# Altium schematic sheet 20_V2X_MODEM.SchDoc
size A3; SheetNumber: 21; SheetTotal: 24
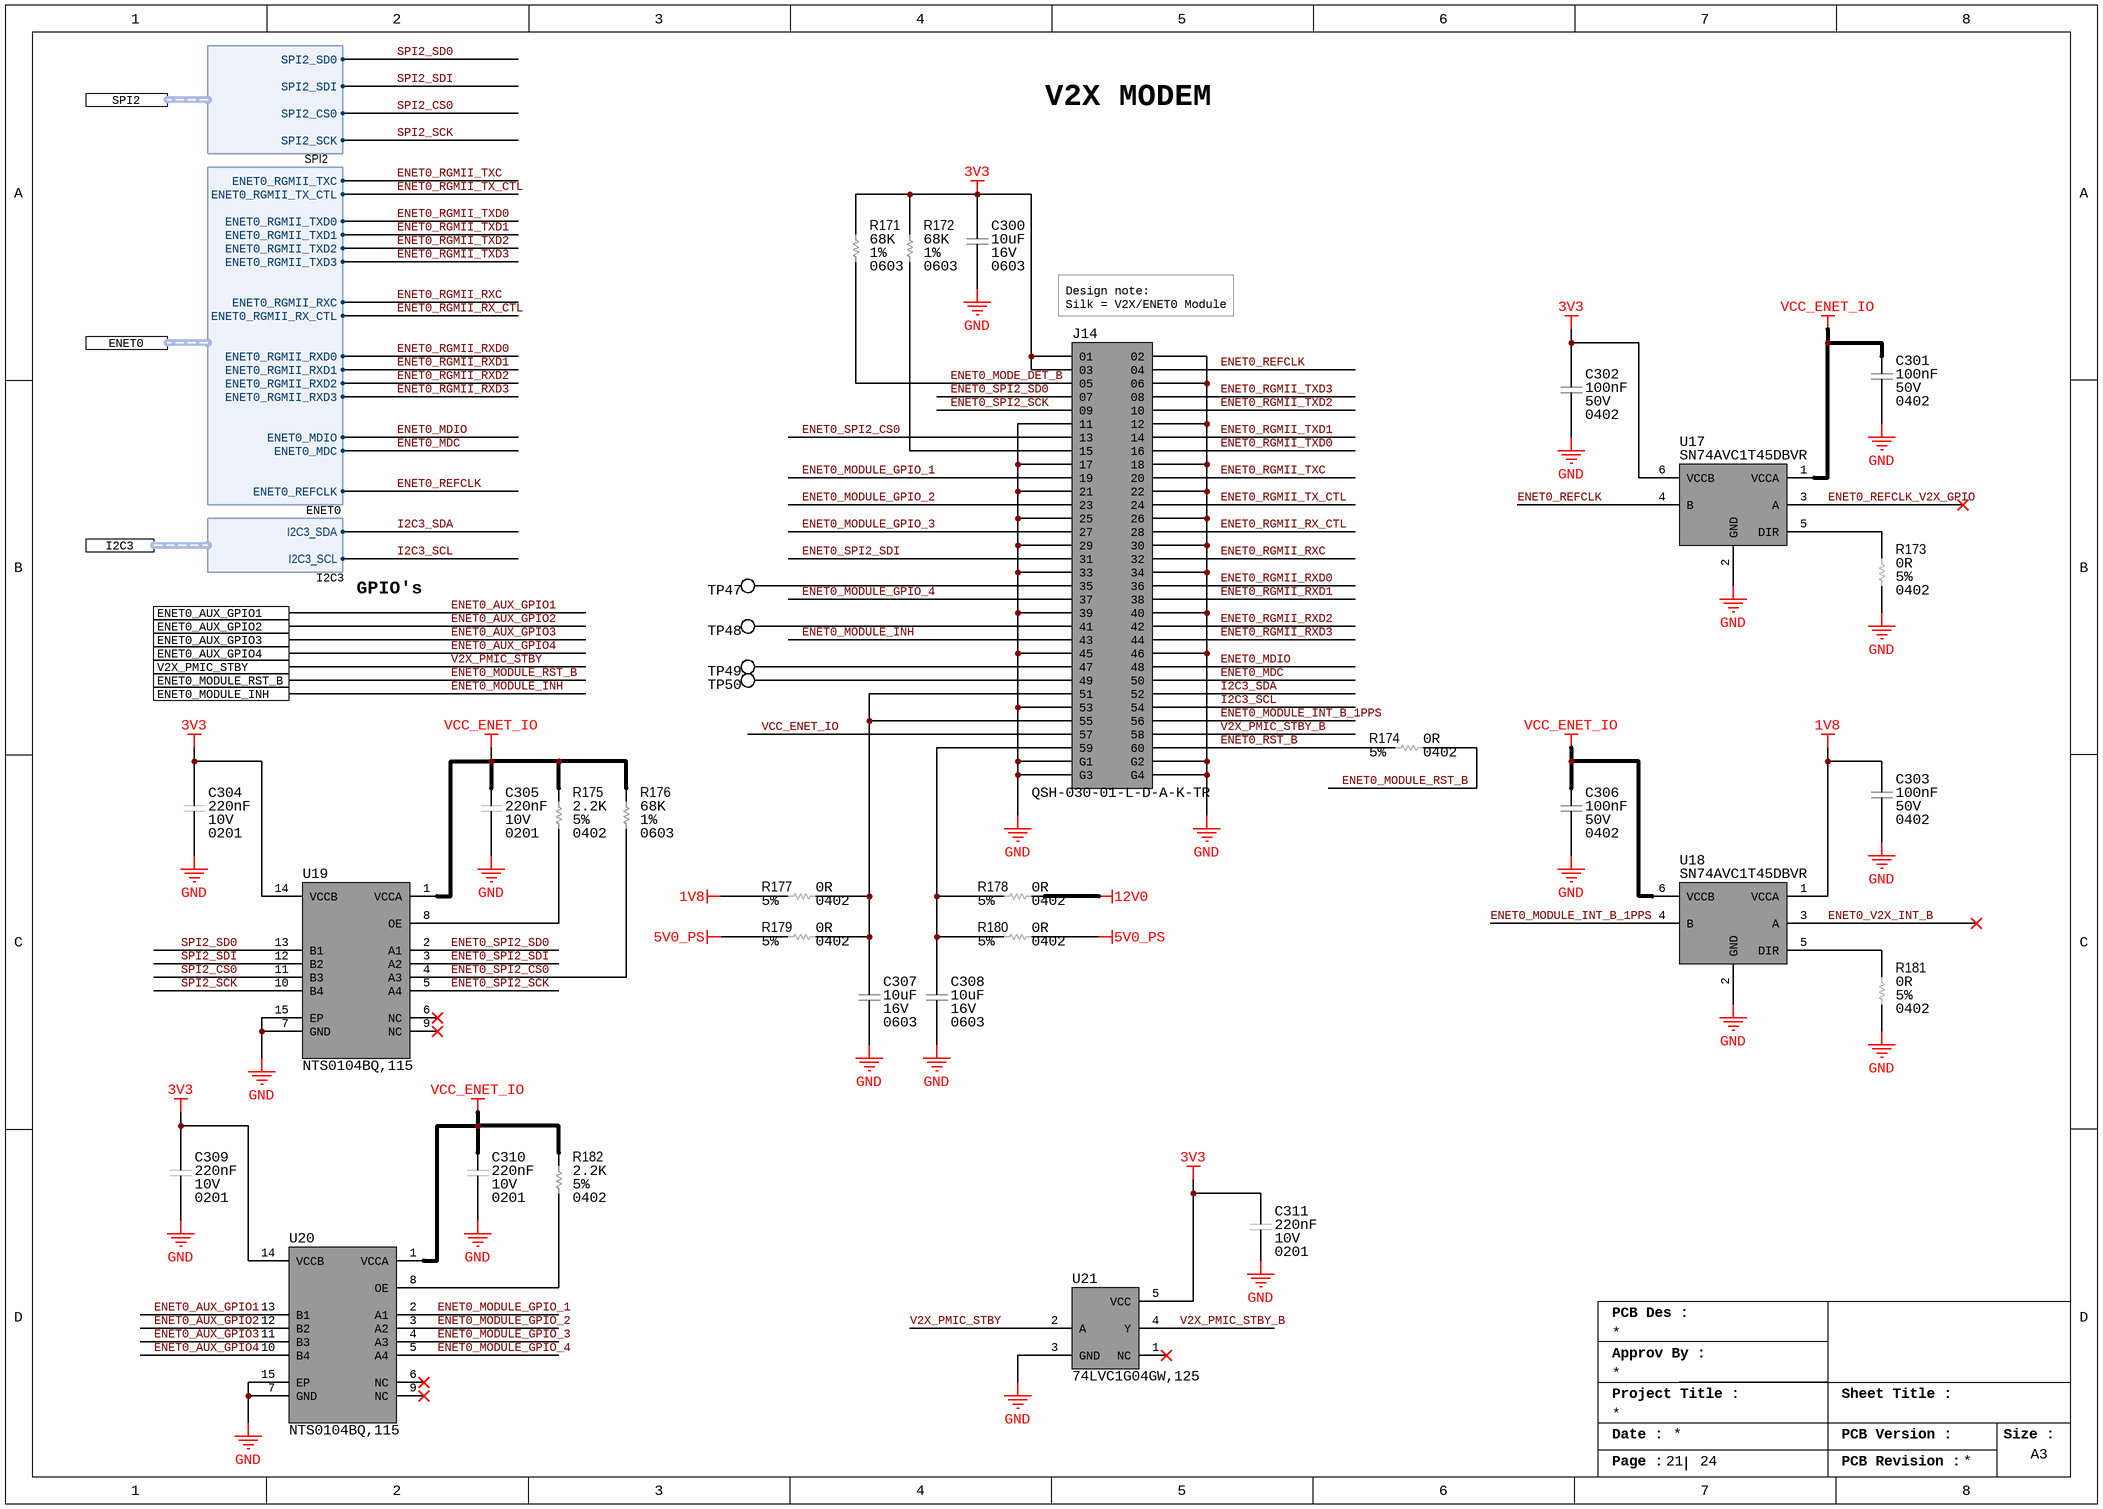
[diagram p0: 20_V2X_MODEM.SchDoc]

## Parts
C300  Voltage Rating: 16V  Capacitance: 10uF  Case/Package: 0603  [CAP_0603_CAPC1608X08N]  (hidden comment: GRM188R61C106MAALD)
C301  Voltage Rating: 50V  Capacitance: 100nF  Case/Package: 0402  [CAP_0402_CAPC1005X05N]  (hidden comment: GRM155R71H104KE14D)
C302  Voltage Rating: 50V  Capacitance: 100nF  Case/Package: 0402  [CAP_0402_CAPC1005X05N]  (hidden comment: GRM155R71H104KE14D)
C303  Voltage Rating: 50V  Capacitance: 100nF  Case/Package: 0402  [CAP_0402_CAPC1005X05N]  (hidden comment: GRM155R71H104KE14D)
C304  Voltage Rating (DC): 10V  Capacitance: 220nF  Case/Package: 0201  [CAP_0201_CAPC0603X03N]  (hidden comment: LMK063BJ224MP-F)
C305  Voltage Rating (DC): 10V  Capacitance: 220nF  Case/Package: 0201  [CAP_0201_CAPC0603X03N]  (hidden comment: LMK063BJ224MP-F)
C306  Voltage Rating: 50V  Capacitance: 100nF  Case/Package: 0402  [CAP_0402_CAPC1005X05N]  (hidden comment: GRM155R71H104KE14D)
C307  Voltage Rating: 16V  Capacitance: 10uF  Case/Package: 0603  [CAP_0603_CAPC1608X08N]  (hidden comment: GRM188R61C106MAALD)
C308  Voltage Rating: 16V  Capacitance: 10uF  Case/Package: 0603  [CAP_0603_CAPC1608X08N]  (hidden comment: GRM188R61C106MAALD)
C309  Voltage Rating (DC): 10V  Capacitance: 220nF  Case/Package: 0201  [CAP_0201_CAPC0603X03N]  (hidden comment: LMK063BJ224MP-F)
C310  Voltage Rating (DC): 10V  Capacitance: 220nF  Case/Package: 0201  [CAP_0201_CAPC0603X03N]  (hidden comment: LMK063BJ224MP-F)
C311  Voltage Rating (DC): 10V  Capacitance: 220nF  Case/Package: 0201  [CAP_0201_CAPC0603X03N]  (hidden comment: LMK063BJ224MP-F)
J14  QSH-030-01-L-D-A-K-TR  [SAMTEC_QSH-030-01-X-D-A-XX]
R171  Tolerance: 1%  Resistance: 68K  Case/Package: 0603  [RES_0603_RESC1608X04N]  (hidden comment: RC0603FR-0768KL)
R172  Tolerance: 1%  Resistance: 68K  Case/Package: 0603  [RES_0603_RESC1608X04N]  (hidden comment: RC0603FR-0768KL)
R173  Case Code (Imperial): 0402  Tolerance: 5%  Resistance: 0R  [RES_0402_RESC1005X04N]  (hidden comment: ERJ-2GE0R00X)
R174  Case Code (Imperial): 0402  Tolerance: 5%  Resistance: 0R  [RES_0402_RESC1005X04N]  (hidden comment: ERJ-2GE0R00X)
R175  Tolerance: 5%  Resistance: 2.2K  Case/Package: 0402  [RES_0402_RESC1005X04N]  (hidden comment: RC0402JR-072K2L)
R176  Tolerance: 1%  Resistance: 68K  Case/Package: 0603  [RES_0603_RESC1608X04N]  (hidden comment: RC0603FR-0768KL)
R177  Case Code (Imperial): 0402  Tolerance: 5%  Resistance: 0R  [RES_0402_RESC1005X04N]  (hidden comment: ERJ-2GE0R00X)
R178  Case Code (Imperial): 0402  Tolerance: 5%  Resistance: 0R  [RES_0402_RESC1005X04N]  (hidden comment: ERJ-2GE0R00X)
R179  Case Code (Imperial): 0402  Tolerance: 5%  Resistance: 0R  [RES_0402_RESC1005X04N]  (hidden comment: ERJ-2GE0R00X)
R180  Case Code (Imperial): 0402  Tolerance: 5%  Resistance: 0R  [RES_0402_RESC1005X04N]  (hidden comment: ERJ-2GE0R00X)
R181  Case Code (Imperial): 0402  Tolerance: 5%  Resistance: 0R  [RES_0402_RESC1005X04N]  (hidden comment: ERJ-2GE0R00X)
R182  Tolerance: 5%  Resistance: 2.2K  Case/Package: 0402  [RES_0402_RESC1005X04N]  (hidden comment: RC0402JR-072K2L)
TP47  NO COMPONENT  [TP_PAD_0.5MM_SMD_ROUND]  (value not drawn)  (no BOM)
TP48  NO COMPONENT  [TP_PAD_0.5MM_SMD_ROUND]  (value not drawn)  (no BOM)
TP49  NO COMPONENT  [TP_PAD_0.5MM_SMD_ROUND]  (value not drawn)  (no BOM)
TP50  NO COMPONENT  [TP_PAD_0.5MM_SMD_ROUND]  (value not drawn)  (no BOM)
U17  SN74AVC1T45DBVR  [SOT95P280X145-6N]
U18  SN74AVC1T45DBVR  [SOT95P280X145-6N]
U19  NTS0104BQ,115  [QFN50P300X250X100-15N]
U20  NTS0104BQ,115  [QFN50P300X250X100-15N]
U21  74LVC1G04GW,125  [SOT65P210X110-5N]

## Ports
ENET0 (harness ENET0), ENET0_AUX_GPIO1, ENET0_AUX_GPIO2, ENET0_AUX_GPIO3, ENET0_AUX_GPIO4, ENET0_MODULE_INH, ENET0_MODULE_RST_B, I2C3 (harness I2C3), SPI2 (harness SPI2), V2X_PMIC_STBY

## Harnesses
SPI2: SPI2_SD0, SPI2_SDI, SPI2_CS0, SPI2_SCK
ENET0: ENET0_RGMII_TXC, ENET0_RGMII_TX_CTL, ENET0_RGMII_TXD0, ENET0_RGMII_TXD1, ENET0_RGMII_TXD2, ENET0_RGMII_TXD3, ENET0_RGMII_RXC, ENET0_RGMII_RX_CTL, ENET0_RGMII_RXD0, ENET0_RGMII_RXD1, ENET0_RGMII_RXD2, ENET0_RGMII_RXD3, ENET0_MDIO, ENET0_MDC, ENET0_REFCLK
I2C3: I2C3_SDA, I2C3_SCL

## Nets
1V8: C303.2 R177.1 U18.1(VCCA)
3V3: C300.2 C302.2 C304.1 C309.1 C311.1 J14.01 J14.03 R171.2 R172.2 U17.6(VCCB) U19.14(VCCB) U20.14(VCCB) U21.5(VCC)
5V0_PS: R179.1 R180.2
12V0: R178.2
GND: C300.1 C301.1 C302.1 C303.1 C304.2 C305.2 C306.1 C307.1 C308.1 C309.2 C310.2 C311.2 J14.02 J14.06 J14.11 J14.12 J14.17 J14.18 J14.21 J14.22 J14.25 J14.26 J14.29 J14.30 J14.33 J14.34 J14.39 J14.40 J14.45 J14.46 J14.53 J14.G1 J14.G2 J14.G3 J14.G4 R173.1 R181.1 U17.2(GND) U18.2(GND) U19.7(GND) U19.15(EP) U20.7(GND) U20.15(EP) U21.3(GND)
VCC_ENET_IO: C301.2 C305.1 C306.2 C310.1 J14.57 R175.2 R176.2 R182.2 U17.1(VCCA) U18.6(VCCB) U19.1(VCCA) U20.1(VCCA)
ENET0_AUX_GPIO1: U20.13(B1) ; port ENET0_AUX_GPIO1
ENET0_AUX_GPIO2: U20.12(B2) ; port ENET0_AUX_GPIO2
ENET0_AUX_GPIO3: U20.11(B3) ; port ENET0_AUX_GPIO3
ENET0_AUX_GPIO4: U20.10(B4) ; port ENET0_AUX_GPIO4
ENET0_MDC: J14.50 ; port ENET0.ENET0_MDC
ENET0_MDIO: J14.48 ; port ENET0.ENET0_MDIO
ENET0_MODE_DET_B: J14.05 R171.1
ENET0_MODULE_GPIO_1: J14.19 U20.2(A1)
ENET0_MODULE_GPIO_2: J14.23 U20.3(A2)
ENET0_MODULE_GPIO_3: J14.27 U20.4(A3)
ENET0_MODULE_GPIO_4: J14.37 U20.5(A4)
ENET0_MODULE_INH: J14.43 ; port ENET0_MODULE_INH
ENET0_MODULE_INT_B_1PPS: J14.56 U18.4(B)
ENET0_MODULE_RST_B: R174.2 ; port ENET0_MODULE_RST_B
ENET0_REFCLK: J14.04 U17.4(B) ; port ENET0.ENET0_REFCLK
ENET0_REFCLK_V2X_GPIO: U17.3(A)
ENET0_RGMII_RX_CTL: J14.28 ; port ENET0.ENET0_RGMII_RX_CTL
ENET0_RGMII_RXC: J14.32 ; port ENET0.ENET0_RGMII_RXC
ENET0_RGMII_RXD0: J14.36 ; port ENET0.ENET0_RGMII_RXD0
ENET0_RGMII_RXD1: J14.38 ; port ENET0.ENET0_RGMII_RXD1
ENET0_RGMII_RXD2: J14.42 ; port ENET0.ENET0_RGMII_RXD2
ENET0_RGMII_RXD3: J14.44 ; port ENET0.ENET0_RGMII_RXD3
ENET0_RGMII_TX_CTL: J14.24 ; port ENET0.ENET0_RGMII_TX_CTL
ENET0_RGMII_TXC: J14.20 ; port ENET0.ENET0_RGMII_TXC
ENET0_RGMII_TXD0: J14.16 ; port ENET0.ENET0_RGMII_TXD0
ENET0_RGMII_TXD1: J14.14 ; port ENET0.ENET0_RGMII_TXD1
ENET0_RGMII_TXD2: J14.10 ; port ENET0.ENET0_RGMII_TXD2
ENET0_RGMII_TXD3: J14.08 ; port ENET0.ENET0_RGMII_TXD3
ENET0_RST_B: J14.60 R174.1
ENET0_SPI2_CS0: J14.13 R176.1 U19.4(A3)
ENET0_SPI2_SCK: J14.09 U19.5(A4)
ENET0_SPI2_SD0: J14.07 U19.2(A1)
ENET0_SPI2_SDI: J14.31 U19.3(A2)
ENET0_V2X_INT_B: U18.3(A)
I2C3_SCL: J14.54 ; port I2C3.I2C3_SCL
I2C3_SDA: J14.52 ; port I2C3.I2C3_SDA
SPI2_CS0: U19.11(B3) ; port SPI2.SPI2_CS0
SPI2_SCK: U19.10(B4) ; port SPI2.SPI2_SCK
SPI2_SD0: U19.13(B1) ; port SPI2.SPI2_SD0
SPI2_SDI: U19.12(B2) ; port SPI2.SPI2_SDI
V2X_PMIC_STBY: U21.2(A) ; port V2X_PMIC_STBY
V2X_PMIC_STBY_B: J14.58 U21.4(Y)
NetC307_2: C307.2 J14.51 J14.55 R177.2 R179.2
NetC308_2: C308.2 J14.59 R178.1 R180.1
NetJ14_15: J14.15 R172.1
NetJ14_35: J14.35 TP47.1
NetJ14_41: J14.41 TP48.1
NetJ14_47: J14.47 TP49.1
NetJ14_49: J14.49 TP50.1
NetR173_2: R173.2 U17.5(DIR)
NetR175_1: R175.1 U19.8(OE)
NetR181_2: R181.2 U18.5(DIR)
NetR182_1: R182.1 U20.8(OE)

Not connected (* = marked no-connect by the designer): U19 6(NC)* 9(NC)*; U20 6(NC)* 9(NC)*; U21 1(NC)*

## Notes on the sheet
- V2X MODEM
- (near J14) Design note:
  Silk = V2X/ENET0 Module
- GPIO's
- PCB Des :
- Approv By :
- Project Title :
- Sheet Title :
- Date :
- PCB Version :
- Size :
- A3
- Page :
- PCB Revision :

## Library data of the parts
C300 C307 C308 = CAP_10UF_16V_X5R_0603: 0603 10 uF 16 V ±20% Tolerance X5R Multilayer Ceramic Chip Capacitor; Manufacturer: Murata; Manufacturer Part Number: GRM188R61C106MAALD; RoHS: Yes; Category: Ceramic Capacitors; Stock 1: 566627; Pricing 1: 1=0.24000, 10=0.16500, 50=0.11000, 100=0.09340, 500=0.06596, 1000=0.05771 (USD); Mount: Surface Mount; Case Code (Metric): 1608; Material: Ceramic; Case Code (Imperial): 0603; Min Operating Temperature: -55°C; Max Operating Temperature: 85°C; Tolerance: 20%; Packaging: Cut Tape; Voltage Rating (DC): 16V; Length: 0.063inch; Width: 0.031inch; Height: 0.8mm; Thickness: 0.037inch; Lead Free: Lead Free; RoHS Compliant: Yes; ComponentLink1URL: http://search.murata.co.jp/Ceramy/image/img/A01X/G101/ENG/GRM188R61C106MAAL-01.pdf?src-supplier=Digi-Key; ComponentLink1Description: http://search.murata.co.jp/Ceramy/image/img/A01X/G101/ENG/GRM188R61C106MAAL-01.pdf?src-supplier=Digi-Key; ComponentLink2URL: https://search.murata.co.jp/Ceramy/image/img/A01X/G101/ENG/GRM188R61C106MAAL-01.pdf?src-supplier=Digi-Key; ComponentLink2Description: https://search.murata.co.jp/Ceramy/image/img/A01X/G101/ENG/GRM188R61C106MAAL-01.pdf?src-supplier=Digi-Key; ComponentLink3URL: http://search.murata.co.jp/Ceramy/image/img/A01X/partnumbering_e_01.pdf?src-supplier=Digi-Key; ComponentLink3Description: http://search.murata.co.jp/Ceramy/image/img/A01X/partnumbering_e_01.pdf?src-supplier=Digi-Key; Supplier 1: Digi-Key; Supplier 2: Verical; Supplier 3: Mouser; Supplier Part Number 1: 490-10729-1-ND; Supplier Part Number 2: GRM188R61C106MAALD; Supplier Part Number 3: 81-GRM188R61C106MALD
C301-C303 C306 = CAP_100NF_50V_X7R_0402: Multilayer Ceramic Capacitor, 0.1 uF, 16 V, ± 10%, X7R, 0402 [1005 Metric]; Manufacturer: Murata; Dissipation Factor: 0.025%; Temperature Coefficient: 30ppm/°C; Supplier 1: DigiKey; Manufacturer Part Number: GRM155R71H104KE14D; RoHS: Yes; Category: Ceramic Capacitors; Stock 1: 13730790; Pricing 1: 1=0.1, 10=0.023, 50=0.0132, 100=0.0102, 500=0.00768, 1000=0.00603, 2500=0.00548, 5000=0.00504 (USD); Mount: Surface Mount; Number of Pins: 2NUMBER; Case Code (Metric): 1005; Material: Ceramic; Case Code (Imperial): 0402; Weight: 0.000212oz; Dielectric Material: Ceramic; Min Operating Temperature: -55°C; Max Operating Temperature: 125°C; Packaging: Tape and Reel; Package Quantity: 10000; Series: GRM; Tolerance: 10%; Dielectric: X7R; Termination: SMD/SMT; Voltage: 50V; Voltage Rating (DC): 50V; Construction: Flat; Length: 1mm; Width: 0.5mm; Height: 0.5mm; Depth: 0.5mm; Thickness: 0.022inch; Reach SVHC Compliant: No; RoHS Compliant: Yes; Lead Free: 5697LeadFree; ComponentLink1URL: http://www.farnell.com/datasheets/2079156.pdf?src-supplier=Farnell; ComponentLink1Description: http://www.farnell.com/datasheets/2079156.pdf?src-supplier=Farnell; ComponentLink2URL: http://www.mouser.com/ds/2/281/c02e-2905.pdf?src-supplier=Mouser; ComponentLink2Description: http://www.mouser.com/ds/2/281/c02e-2905.pdf?src-supplier=Mouser; ComponentLink3URL: http://www.farnell.com/datasheets/2079156.pdf?src-supplier=Newark; ComponentLink3Description: http://www.farnell.com/datasheets/2079156.pdf?src-supplier=Newark; ComponentLink4URL: https://datasheet.octopart.com/GRM155R71H104KE14D-Murata-datasheet-22122223.pdf?src-supplier=Future+Electronics; ComponentLink4Description: https://datasheet.octopart.com/GRM155R71H104KE14D-Murata-datasheet-22122223.pdf?src-supplier=Future+Electronics; ComponentLink5URL: https://search.murata.co.jp/Ceramy/image/img/A01X/G101/ENG/GRM155R71H104KE14-01.pdf?src-supplier=Digi-Key; ComponentLink5Description: https://search.murata.co.jp/Ceramy/image/img/A01X/G101/ENG/GRM155R71H104KE14-01.pdf?src-supplier=Digi-Key; ComponentLink6URL: http://psearch.en.murata.com/capacitor/product/GRM155R71H104KE14%23.pdf?src-supplier=Avnet; ComponentLink6Description: http://psearch.en.murata.com/capacitor/product/GRM155R71H104KE14%23.pdf?src-supplier=Avnet; ComponentLink7URL: https://datasheet.octopart.com/GRM155R71H104KE14D-Murata-datasheet-66077078.pdf?src-supplier=Element14; ComponentLink7Description: https://datasheet.octopart.com/GRM155R71H104KE14D-Murata-datasheet-66077078.pdf?src-supplier=Element14; Supplier Part Number 1: 490-10700-6-ND; Supplier 2: Digikey; Stock 2: 3706055; Pricing 2: 1=0.1, 10=0.037, 50=0.021, 100=0.0162, 500=0.01224, 1000=0.00961, 2500=0.00874, 5000=0.00804 (USD); Halogen Free: 5694HalogenFree; ComponentLink8URL: http://www.mouser.com/ds/2/447/UPY-GPHC_X5R_4V-to-50V_25-1131599.pdf?src-supplier=Mouser; ComponentLink8Description: http://www.mouser.com/ds/2/447/UPY-GPHC_X5R_4V-to-50V_25-1131599.pdf?src-supplier=Mouser; ComponentLink9URL: https://datasheet.octopart.com/CC0402KRX5R8BB104-Yageo-datasheet-137700082.pdf?src-supplier=Future+Electronics; ComponentLink9Description: https://datasheet.octopart.com/CC0402KRX5R8BB104-Yageo-datasheet-137700082.pdf?src-supplier=Future+Electronics; ComponentLink10URL: http://www.yageo.com/documents/recent/UPY-GPHC_X5R_4V-to-50V_25.pdf?src-supplier=Digikey; ComponentLink10Description: http://www.yageo.com/documents/recent/UPY-GPHC_X5R_4V-to-50V_25.pdf?src-supplier=Digikey; ComponentLink11URL: https://datasheet.octopart.com/CC0402KRX5R8BB104-Yageo-datasheet-140260304.pdf?src-supplier=Newark; ComponentLink11Description: https://datasheet.octopart.com/CC0402KRX5R8BB104-Yageo-datasheet-140260304.pdf?src-supplier=Newark; ComponentLink12URL: https://datasheet.octopart.com/CC0402KRX5R8BB104-Yageo-datasheet-170350636.pdf?src-supplier=Future+Electronics; ComponentLink12Description: https://datasheet.octopart.com/CC0402KRX5R8BB104-Yageo-datasheet-170350636.pdf?src-supplier=Future+Electronics; ComponentLink13URL: http://www.yageo.com/documents/recent/UPY-GPHC_X5R_4V-to-50V-16.pdf?src-supplier=Future+Electronics; ComponentLink13Description: http://www.yageo.com/documents/recent/UPY-GPHC_X5R_4V-to-50V-16.pdf?src-supplier=Future+Electronics; Supplier Part Number 2: 311-1697-1-ND
C304 C305 C309-C311 = CAP_0.22UF_10V_X5R_0201: Multilayer Ceramic Capacitors (High dielectric type), 10V, 0.22 uF, ± 20 %, 0201, X5R, RoHS; Manufacturer: Taiyo Yuden; Material: 4241ConductorMaterial; Tolerance: 20%; Supplier 1: Digikey; Manufacturer Part Number: LMK063BJ224MP-F; RoHS: Yes; Category: Ceramic Capacitors; Stock 1: 6053224; Pricing 1: 1=0.12, 10=0.08, 50=0.0478, 100=0.0375, 500=0.02772, 1000=0.02295, 2500=0.02136, 5000=0.01954 (USD); Mount: Surface Mount; Case Code (Metric): 0603; Case Code (Imperial): 0201; Min Operating Temperature: -55°C; Max Operating Temperature: 85°C; Voltage Rating: 10V; Packaging: Tape and Reel; Package Quantity: 15000; Dielectric: X5R; Termination: SMD/SMT; Voltage: 10V; Series: M; Construction: Flat; Length: 0.6mm; Width: 0.3mm; Height: 0.3mm; Depth: 0.3mm; Radiation Hardening: No; Halogen Free: Halogen Free; RoHS Compliant: Yes; Reach SVHC Compliant: Unknown; ComponentLink1URL: https://datasheet.ciiva.com/134/lmk063bj224mp-f-ss-134995.pdf?src-supplier=Digikey; ComponentLink1Description: https://datasheet.ciiva.com/134/lmk063bj224mp-f-ss-134995.pdf?src-supplier=Digikey; ComponentLink2URL: https://datasheet.ciiva.com/11464/lmk063bj224mp-f-ss-11464053.pdf?src-supplier=Avnet; ComponentLink2Description: https://datasheet.ciiva.com/11464/lmk063bj224mp-f-ss-11464053.pdf?src-supplier=Avnet; ComponentLink3URL: https://datasheet.ciiva.com/15921/1589lmk063bj224mp-f-15921250.pdf?src-supplier=Onlinecomponents.com; ComponentLink3Description: https://datasheet.ciiva.com/15921/1589lmk063bj224mp-f-15921250.pdf?src-supplier=Onlinecomponents.com; ComponentLink4URL: https://datasheet.ciiva.com/26872/getdatasheetpartid-639019-26872592.pdf?src-supplier=Verical; ComponentLink4Description: https://datasheet.ciiva.com/26872/getdatasheetpartid-639019-26872592.pdf?src-supplier=Verical; ComponentLink5URL: https://datasheet.ciiva.com/30243/100lmk063bj224mp-f-30243150.pdf?src-supplier=Onlinecomponents.com; ComponentLink5Description: https://datasheet.ciiva.com/30243/100lmk063bj224mp-f-30243150.pdf?src-supplier=Onlinecomponents.com; ComponentLink6URL: https://datasheet.ciiva.com/28645/746258-28645141.pdf?src-supplier=Element14; ComponentLink6Description: https://datasheet.ciiva.com/28645/746258-28645141.pdf?src-supplier=Element14; ComponentLink7URL: https://datasheet.ciiva.com/5422/mlcc-all-e-541559-5422365.pdf?src-supplier=Mouser; ComponentLink7Description: https://datasheet.ciiva.com/5422/mlcc-all-e-541559-5422365.pdf?src-supplier=Mouser; Supplier Part Number 1: 587-2483-1-ND
J14 = CONN_MEZZANINE_60P_0.5mm_QSH-030-01-L-D-A-K-TR: Board to Board & Mezzanine Connectors 0.50 mm Q Strip High-Speed Ground Plane Socket Strip; Manufacturer: Samtec; Number of Contacts: 60; Max Voltage Rating (AC): 125V; Gender: Female; Pitch: 0.5mm; Supplier 1: Digikey; Manufacturer Part Number: QSH-030-01-L-D-A-K-TR; RoHS: Yes; Category: Connectors; Stock 1: 6997; Pricing 1: 1=5.77, 50=5.29, 100=4.96, 250=4.47 (USD); Contact Plating: Gold; Contact Material: Bronze; Housing Color: Black; Housing Material: Polymer; Min Operating Temperature: -55°C; Max Operating Temperature: 125°C; Number of Rows: 2; Packaging: Tape and Reel; Termination: Solder; Orientation: Straight; Voltage Rating (AC): 125V; Length: 21.27mm; Depth: 7.49mm; Radiation Hardening: No; Lead Free: Lead Free; RoHS Compliant: Yes; ComponentLink1URL: https://datasheet.ciiva.com/9698/qsh-9698069.pdf?src-supplier=Avnet; ComponentLink1Description: https://datasheet.ciiva.com/9698/qsh-9698069.pdf?src-supplier=Avnet; ComponentLink2URL: https://datasheet.ciiva.com/9698/qsh-9698108.pdf?src-supplier=Avnet; ComponentLink2Description: https://datasheet.ciiva.com/9698/qsh-9698108.pdf?src-supplier=Avnet; ComponentLink3URL: https://datasheet.ciiva.com/9698/qsh-9698110.pdf?src-supplier=Avnet; ComponentLink3Description: https://datasheet.ciiva.com/9698/qsh-9698110.pdf?src-supplier=Avnet; Supplier Part Number 1: 612-QSH-030-01-L-D-A-K-TRCT-ND
R171 R172 R176 = RES_68K_1%_100mW_0603: SMD Chip Resistor, 68 kOhm, ± 1%, 100 mW, 0603 [1608 Metric], Thick Film, General Purpose; Manufacturer: Yageo; Power Rating: 100mW; Voltage Rating: 50V; Temperature Coefficient: 100ppm/°C; Supplier 1: Digikey; Manufacturer Part Number: RC0603FR-0768KL; RoHS: Yes; Category: Chip SMD Resistors; Stock 1: 465324; Pricing 1: 1=0.1, 10=0.012, 50=0.0096, 100=0.0071, 500=0.00662, 1000=0.00612 (USD); Number of Pins: 2; Case Code (Metric): 1608; Case Code (Imperial): 0603; Size Code: 0603; Min Operating Temperature: -55°C; Max Operating Temperature: 155°C; Package Quantity: 1; Packaging: Tape and Reel; Voltage Rating (DC): 50V; Resistor Type: Thick Film; Number of Terminations: 2; Termination: SMD/SMT; Max Power Dissipation: 100mW; Features: Moisture Resistant; Series: RC; Resistance Tolerance: 1%; Technology: THICK FILM; Voltage Rating (AC): 50V; Length: 0.063inch; Width: 0.031inch; Height: 0.022inch; Depth: 0.8mm; Reach SVHC Compliant: No; Lead Free: Lead Free; RoHS Compliant: Yes; ComponentLink1URL: https://datasheet.ciiva.com/11819/0900766b80f96399-11819412.pdf?src-supplier=Rs; ComponentLink1Description: https://datasheet.ciiva.com/11819/0900766b80f96399-11819412.pdf?src-supplier=Rs; ComponentLink2URL: https://datasheet.ciiva.com/2454/pyu-r-int-thick-7-2454147.pdf?src-supplier=Digikey; ComponentLink2Description: https://datasheet.ciiva.com/2454/pyu-r-int-thick-7-2454147.pdf?src-supplier=Digikey; ComponentLink3URL: https://datasheet.ciiva.com/2454/pyu-r-int-thick-7-2454148.pdf?src-supplier=Digikey; ComponentLink3Description: https://datasheet.ciiva.com/2454/pyu-r-int-thick-7-2454148.pdf?src-supplier=Digikey; ComponentLink4URL: https://datasheet.ciiva.com/2454/pyu-r-int-thick-7-2454149.pdf?src-supplier=Digikey; ComponentLink4Description: https://datasheet.ciiva.com/2454/pyu-r-int-thick-7-2454149.pdf?src-supplier=Digikey; ComponentLink5URL: https://datasheet.ciiva.com/7983/443971-7983658.pdf?src-supplier=Element14; ComponentLink5Description: https://datasheet.ciiva.com/7983/443971-7983658.pdf?src-supplier=Element14; ComponentLink6URL: https://datasheet.ciiva.com/46412/443971-46412855.pdf?src-supplier=Element14; ComponentLink6Description: https://datasheet.ciiva.com/46412/443971-46412855.pdf?src-supplier=Element14; ComponentLink7URL: https://datasheet.ciiva.com/7746/443971-7746390.pdf?src-supplier=Element14; ComponentLink7Description: https://datasheet.ciiva.com/7746/443971-7746390.pdf?src-supplier=Element14; ComponentLink8URL: https://datasheet.ciiva.com/7746/443971-7746391.pdf?src-supplier=Element14; ComponentLink8Description: https://datasheet.ciiva.com/7746/443971-7746391.pdf?src-supplier=Element14; Supplier Part Number 1: 311-68.0KHRCT-ND
R173 R174 R177-R181 = RES_0R_5%_100mW_0402: SMD Chip Resistor, Jumper, 0 ohm, 100 mW, 0402 [1005 Metric], Thick Film, General Purpose; Manufacturer: Panasonic; Power Rating: 100mW; Voltage Rating: 50V; Temperature Coefficient: 600ppm/°C; Supplier 1: Mouser; Manufacturer Part Number: ERJ-2GE0R00X; RoHS: Yes; Category: Chip SMD Resistors; Stock 1: 10989354; Pricing 1: 1=0.1, 10=0.013, 50=0.013, 100=0.006, 1000=0.004, 2500=0.003, 10000=0.003 (USD); Mount: Surface Mount; Case/Package: 0402; Contact Plating: Tin; Case Code (Metric): 1005; Size Code: 0402; Min Operating Temperature: -55°C; Max Operating Temperature: 155°C; Resistor Type: Thick Film; Packaging: Cut Tape; Package Quantity: 10000; Number of Terminations: 2; Termination: SMD/SMT; Max Power Dissipation: 100mW; Voltage Rating (DC): 50V; Features: Automotive AEC-Q200; Series: ERJ; Construction: Rectangular; Technology: THICK FILM; Length: 1mm; Width: 0.5mm; Height: 0.35mm; Depth: 0.5mm; Ratings: AEC-Q200; Radiation Hardening: No; Reach SVHC Compliant: No; Military Standard: Not; Lead Free: Lead Free; RoHS Compliant: Yes; ComponentLink1URL: https://datasheet.ciiva.com/11821/0900766b80f806dd-11821176.pdf?src-supplier=Rs; ComponentLink1Description: https://datasheet.ciiva.com/11821/0900766b80f806dd-11821176.pdf?src-supplier=Rs; ComponentLink2URL: https://datasheet.ciiva.com/43460/1678796-43460347.pdf?src-supplier=Farnell; ComponentLink2Description: https://datasheet.ciiva.com/43460/1678796-43460347.pdf?src-supplier=Farnell; ComponentLink3URL: https://datasheet.ciiva.com/46389/1678796-46389518.pdf?src-supplier=Element14; ComponentLink3Description: https://datasheet.ciiva.com/46389/1678796-46389518.pdf?src-supplier=Element14; ComponentLink4URL: https://datasheet.ciiva.com/5959/1678796-5959692.pdf?src-supplier=Farnell; ComponentLink4Description: https://datasheet.ciiva.com/5959/1678796-5959692.pdf?src-supplier=Farnell; ComponentLink5URL: https://datasheet.ciiva.com/28695/1678796-28695758.pdf?src-supplier=Element14; ComponentLink5Description: https://datasheet.ciiva.com/28695/1678796-28695758.pdf?src-supplier=Element14; ComponentLink6URL: https://datasheet.ciiva.com/16783/70260739-16783734.pdf?src-supplier=Allied+Electronics; ComponentLink6Description: https://datasheet.ciiva.com/16783/70260739-16783734.pdf?src-supplier=Allied+Electronics; ComponentLink7URL: https://datasheet.ciiva.com/16778/70260739-16778335.pdf?src-supplier=Allied+Electronics; ComponentLink7Description: https://datasheet.ciiva.com/16778/70260739-16778335.pdf?src-supplier=Allied+Electronics; ComponentLink8URL: https://datasheet.ciiva.com/48531/aoa0000ce1-48531077.pdf?src-supplier=Avnet; ComponentLink8Description: https://datasheet.ciiva.com/48531/aoa0000ce1-48531077.pdf?src-supplier=Avnet; ComponentLink9URL: https://datasheet.ciiva.com/30097/4aoa0000ce1-30097116.pdf?src-supplier=Onlinecomponents.com; ComponentLink9Description: https://datasheet.ciiva.com/30097/4aoa0000ce1-30097116.pdf?src-supplier=Onlinecomponents.com; Supplier Part Number 1: 667-ERJ-2GE0R00X
R175 R182 = RES_2.2K_5%_63mW_0402: SMD Chip Resistor, 2.2 kOhm, ± 5%, 63 mW, 0402 [1005 Metric], Thick Film, General Purpose; Manufacturer: Yageo; Power Rating: 62.5mW; Voltage Rating: 50V; Temperature Coefficient: 100ppm/°C; Max Power Dissipation: 63mW; Supplier 1: Mouser; Manufacturer Part Number: RC0402JR-072K2L; RoHS: Yes; Category: Chip SMD Resistors; Stock 1: 27488; Pricing 1: 1=0.1, 10=0.011, 50=0.011, 100=0.006, 1000=0.005, 10000=0.002 (USD); Case Code (Metric): 1005; Case Code (Imperial): 0402; Weight: 2.3E-05oz; Min Operating Temperature: -55°C; Max Operating Temperature: 155°C; Package Quantity: 1; Packaging: Tape and Reel; Resistor Type: Thick Film; Number of Terminations: 2; Termination: SMD/SMT; Working Voltage: 50V; Features: Moisture Resistant; Series: RC; Resistance Tolerance: 5%; Construction: Rectangular; Technology: THICK FILM; Voltage Rating (AC): 50V; Length: 1mm; Width: 0.02inch; Height: 0.016inch; Depth: 0.5mm; Reach SVHC Compliant: No; Military Standard: Not; RoHS Compliant: Yes; Lead Free: 5697LeadFree; ComponentLink1URL: https://datasheet.ciiva.com/2518/pyu-r-int-thick-7-2518881.pdf?src-supplier=Digikey; ComponentLink1Description: https://datasheet.ciiva.com/2518/pyu-r-int-thick-7-2518881.pdf?src-supplier=Digikey; ComponentLink2URL: https://datasheet.ciiva.com/2518/pyu-r-int-thick-7-2518882.pdf?src-supplier=Digikey; ComponentLink2Description: https://datasheet.ciiva.com/2518/pyu-r-int-thick-7-2518882.pdf?src-supplier=Digikey; ComponentLink3URL: https://datasheet.ciiva.com/2518/pyu-r-int-thick-7-2518880.pdf?src-supplier=Digikey; ComponentLink3Description: https://datasheet.ciiva.com/2518/pyu-r-int-thick-7-2518880.pdf?src-supplier=Digikey; ComponentLink4URL: https://datasheet.ciiva.com/12577/pyu-rc0402-51-rohs-l-6-r-12577433.pdf?src-supplier=Mouser; ComponentLink4Description: https://datasheet.ciiva.com/12577/pyu-rc0402-51-rohs-l-6-r-12577433.pdf?src-supplier=Mouser; ComponentLink5URL: https://datasheet.ciiva.com/7850/1018594-7850191.pdf?src-supplier=Element14; ComponentLink5Description: https://datasheet.ciiva.com/7850/1018594-7850191.pdf?src-supplier=Element14; ComponentLink6URL: https://datasheet.ciiva.com/7850/1018594-7850190.pdf?src-supplier=Element14; ComponentLink6Description: https://datasheet.ciiva.com/7850/1018594-7850190.pdf?src-supplier=Element14; ComponentLink7URL: https://datasheet.ciiva.com/16741/pyu-rc0402-51-rohs-l-6-r-16741086.pdf?src-supplier=Future+Electronics; ComponentLink7Description: https://datasheet.ciiva.com/16741/pyu-rc0402-51-rohs-l-6-r-16741086.pdf?src-supplier=Future+Electronics; ComponentLink8URL: https://datasheet.ciiva.com/15189/getdatasheetpartid-327800-15189558.pdf?src-supplier=Verical; ComponentLink8Description: https://datasheet.ciiva.com/15189/getdatasheetpartid-327800-15189558.pdf?src-supplier=Verical; Supplier Part Number 1: 603-RC0402JR-072K2L
TP47-TP50 = TP_PAD_SMD_SMALL: Test Point, SMD pad, round, 1.5mm, 1.6mm, 3mm diameter
U17 U18 = IC_LEVEL_TRANSLATE_1CH_SN74AVC1T45DBVR: 1.2V~3.6V 1 1 1.2V~3.6V 500Mbps SOT-23-6 Translators / Level Shifters ROHS; Manufacturer: Texas Instruments; Number of Channels: 1; Propagation Delay: 5.6ns; Max Supply Voltage: 3.6V; Min Supply Voltage: 1.2V; Logic Function: Transceiver,Inverting,Translator; Turn-On Delay Time: 13.6ns; Low Level Output Current: 12mA; High Level Output Current: -12mA; Quiescent Current: 20uA; Polarity: Non-Inverting; Number of Outputs: 2; Output Type: 3-STATE; Channel Type: Bidirectional; Supplier 1: Digikey; Manufacturer Part Number: SN74AVC1T45DBVR; RoHS: Yes; Category: Voltage Level Shifters; Stock 1: 118671; Pricing 1: 1=0.58, 10=0.408, 25=0.3652, 100=0.3182, 250=0.2958, 500=0.28232, 1000=0.27535 (USD); Mount: Surface Mount; Case/Package: SOT-23; Number of Pins: 6; Weight: 0.000229oz; Min Operating Temperature: -40°C; Max Operating Temperature: 85°C; Data Rate: 500Mbps; Packaging: Tape and Reel; Number of Bits: 1; Number of Elements: 1; Output Current: 12mA; Series: 74AVC; Technology: CMOS; Number of Circuits: 1; Number of Transmitters: 2; Number of Receivers: 2; Number of Inputs: 1; Number of Transceivers: 1; Nominal Supply Current: 20uA; Length: 3.05mm; Width: 1.75mm; Height: 1.45mm; Thickness: 1.2mm; Radiation Hardening: No; Lead Free: Lead Free; RoHS Compliant: Yes; Reach SVHC Compliant: No; ComponentLink1URL: https://datasheet.ciiva.com/15086/getdatasheetpartid-251058-15086540.pdf?src-supplier=Verical; ComponentLink1Description: https://datasheet.ciiva.com/15086/getdatasheetpartid-251058-15086540.pdf?src-supplier=Verical; ComponentLink2URL: https://datasheet.ciiva.com/23785/1635556-23785532.pdf?src-supplier=Newark; ComponentLink2Description: https://datasheet.ciiva.com/23785/1635556-23785532.pdf?src-supplier=Newark; ComponentLink3URL: https://datasheet.ciiva.com/1899/sn74avc1t45-1899272.pdf?src-supplier=Digikey; ComponentLink3Description: https://datasheet.ciiva.com/1899/sn74avc1t45-1899272.pdf?src-supplier=Digikey; ComponentLink4URL: https://datasheet.ciiva.com/1899/sn74avc1t45-1899273.pdf?src-supplier=Digikey; ComponentLink4Description: https://datasheet.ciiva.com/1899/sn74avc1t45-1899273.pdf?src-supplier=Digikey; ComponentLink5URL: https://datasheet.ciiva.com/1899/sn74avc1t45-1899274.pdf?src-supplier=Digikey; ComponentLink5Description: https://datasheet.ciiva.com/1899/sn74avc1t45-1899274.pdf?src-supplier=Digikey; ComponentLink6URL: https://datasheet.ciiva.com/14287/sn74avc1t45-14287319.pdf?src-supplier=Avnet; ComponentLink6Description: https://datasheet.ciiva.com/14287/sn74avc1t45-14287319.pdf?src-supplier=Avnet; ComponentLink7URL: https://datasheet.ciiva.com/1508/1862374-1508649.pdf?src-supplier=Element14; ComponentLink7Description: https://datasheet.ciiva.com/1508/1862374-1508649.pdf?src-supplier=Element14; Supplier Part Number 1: 296-19094-1-ND
U19 U20 = IC_LEVEL_TRASLATE_4CH_NTS0104BQ,115: Voltage Level Translator Bidirectional 1 Circuit 4 Channel 50Mbps 14-DHVQFN (2.5x3); Manufacturer: NXP Semiconductors; Number of Channels: 4; Min Supply Voltage: 1.65V; Max Supply Voltage: 5.5V; Propagation Delay: 280ns; Max Power Dissipation: 250mW; Turn-On Delay Time: 5.8ns; Low Level Output Current: 1mA; High Level Output Current: -20uA; Quiescent Current: 45uA; Number of Elements: 1; Polarity: Non-Inverting; Operating Frequency-Max: 10MHz; Supplier 1: Digikey; Manufacturer Part Number: NTS0104BQ,115; RoHS: Yes; Category: Voltage Level Shifters; Stock 1: 34508; Pricing 1: 1=0.91, 10=0.655, 25=0.5904, 100=0.5192, 250=0.48524, 500=0.46478, 1000=0.46359 (USD); Mount: Surface Mount; Number of Pins: 14; Min Operating Temperature: -40°C; Max Operating Temperature: 125°C; Data Rate: 50Mbps; Packaging: Tape and Reel; Package Quantity: 1; Logic Function: Translator; Number of Bits: 4; Output Type: Voltage; Series: -; Radiation Hardening: No; Reach SVHC Compliant: No; Lead Free: Lead Free; RoHS Compliant: Yes; ComponentLink1URL: https://datasheet.ciiva.com/15096/getdatasheetpartid-509197-15096330.pdf?src-supplier=Verical; ComponentLink1Description: https://datasheet.ciiva.com/15096/getdatasheetpartid-509197-15096330.pdf?src-supplier=Verical; ComponentLink2URL: https://datasheet.ciiva.com/1899/nts0104-1899077.pdf?src-supplier=Digikey; ComponentLink2Description: https://datasheet.ciiva.com/1899/nts0104-1899077.pdf?src-supplier=Digikey; ComponentLink3URL: https://datasheet.ciiva.com/1899/nts0104-1899078.pdf?src-supplier=Digikey; ComponentLink3Description: https://datasheet.ciiva.com/1899/nts0104-1899078.pdf?src-supplier=Digikey; ComponentLink4URL: https://datasheet.ciiva.com/1899/nts0104-1899079.pdf?src-supplier=Digikey; ComponentLink4Description: https://datasheet.ciiva.com/1899/nts0104-1899079.pdf?src-supplier=Digikey; ComponentLink5URL: https://datasheet.ciiva.com/8244/nts0104-8244157.pdf?src-supplier=Avnet; ComponentLink5Description: https://datasheet.ciiva.com/8244/nts0104-8244157.pdf?src-supplier=Avnet; Supplier Part Number 1: 568-8407-1-ND
U21 = IC_INVERTER_1CH_74LVC1G04GW,125: 74LVC Series 5.5 V Surface Mount Single Inverting Buffer - TSSOP-5; Manufacturer: Nexperia; Max Supply Voltage: 5.5V; Min Supply Voltage: 1.65V; Number of Circuits: 1; Output Current: 32mA; Propagation Delay: 1.6ns; Frequency: 175MHz; Nominal Supply Current: 0A; Supplier 1: Digikey; Manufacturer Part Number: 74LVC1G04GW,125; RoHS: Yes; Category: Logic Gates; Stock 1: 14827; Pricing 1: 1=0.1, 10=0.062, 25=0.0544, 100=0.0455, 250=0.04128, 500=0.03874, 1000=0.03666 (USD); Number of Pins: 5; Min Operating Temperature: -40°C; Max Operating Temperature: 125°C; Logic Function: Inverting; Number of Inputs: 1; Number of Outputs: 1; Height: 1.1mm; RoHS Compliant: Yes; ComponentLink1URL: http://www.farnell.com/datasheets/2185286.pdf?src-supplier=Farnell; ComponentLink1Description: http://www.farnell.com/datasheets/2185286.pdf?src-supplier=Farnell; ComponentLink2URL: https://assets.nexperia.com/documents/data-sheet/74LVC1G04.pdf?src-supplier=Digikey; ComponentLink2Description: https://assets.nexperia.com/documents/data-sheet/74LVC1G04.pdf?src-supplier=Digikey; ComponentLink3URL: https://datasheet.octopart.com/74LVC1G04GW%2C125-Philips-datasheet-5390092.pdf?src-supplier=Future+Electronics; ComponentLink3Description: https://datasheet.octopart.com/74LVC1G04GW%2C125-Philips-datasheet-5390092.pdf?src-supplier=Future+Electronics; ComponentLink4URL: https://datasheet.octopart.com/74LVC1G04GW%2C125-Nexperia-datasheet-12533668.pdf?src-supplier=Element14; ComponentLink4Description: https://datasheet.octopart.com/74LVC1G04GW%2C125-Nexperia-datasheet-12533668.pdf?src-supplier=Element14; Supplier Part Number 1: 1727-2871-1-ND